# EAGLE design PowerLcd (EAGLE 9.6.2)
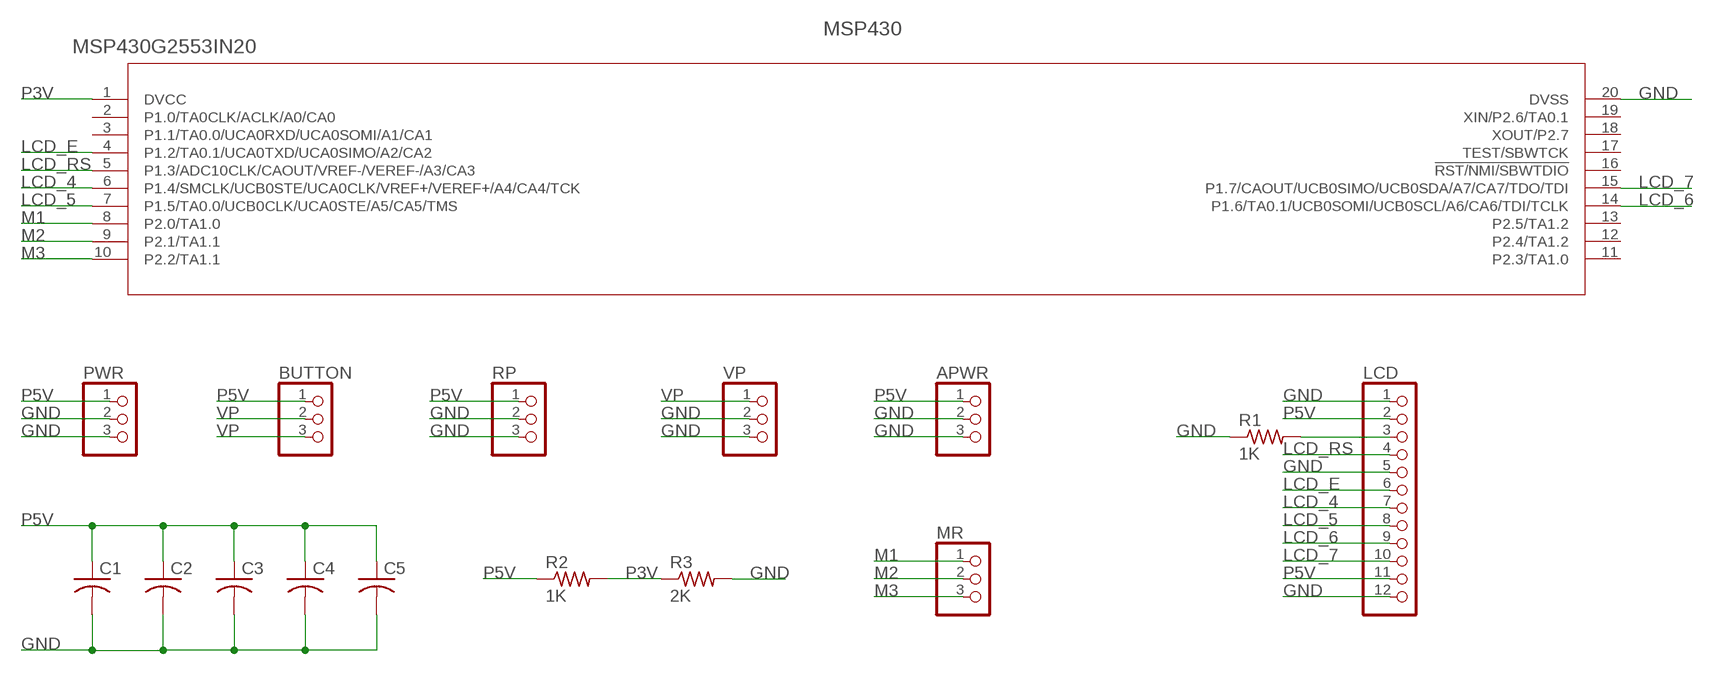
[diagram p0: schematic, sheet 1]

## Parts
APWR  PINHD-1X3  [1X03]
BUTTON  PINHD-1X3  [1X03]
C1  C-US075-042X103  [C075-042X103]
C2  C-US075-042X103  [C075-042X103]
C3  C-US075-042X103  [C075-042X103]
C4  C-US075-042X103  [C075-042X103]
C5  C-US075-042X103  [C075-042X103]
LCD  PINHD-1X12  [1X12]
MR  PINHD-1X3  [1X03]
MSP430  MSP430G2553IN20  [N20_TEX]
PWR  PINHD-1X3  [1X03]
R1  1K  R-US_0204/5  [0204/5]
R2  1K  R-US_0204/5  [0204/5]
R3  2K  R-US_0204/5  [0204/5]
RP  PINHD-1X3  [1X03]
VP  PINHD-1X3  [1X03]

## Nets
GND: APWR.2 APWR.3 C1.2 C2.2 C3.2 C4.2 C5.2 LCD.1 LCD.5 LCD.12 MSP430.20(DVSS) PWR.2 PWR.3 R1.1 R3.2 RP.2 RP.3 VP.2 VP.3
LCD_4: LCD.7 MSP430.6(P1.4/SMCLK/UCB0STE/UCA0CLK/VREF+/VEREF+/A4/CA4/TCK)
LCD_5: LCD.8 MSP430.7(P1.5/TA0.0/UCB0CLK/UCA0STE/A5/CA5/TMS)
LCD_6: LCD.9 MSP430.14(P1.6/TA0.1/UCB0SOMI/UCB0SCL/A6/CA6/TDI/TCLK)
LCD_7: LCD.10 MSP430.15(P1.7/CAOUT/UCB0SIMO/UCB0SDA/A7/CA7/TDO/TDI)
LCD_E: LCD.6 MSP430.4(P1.2/TA0.1/UCA0TXD/UCA0SIMO/A2/CA2)
LCD_RS: LCD.4 MSP430.5(P1.3/ADC10CLK/CAOUT/VREF-/VEREF-/A3/CA3)
M1: MR.1 MSP430.8(P2.0/TA1.0)
M2: MR.2 MSP430.9(P2.1/TA1.1)
M3: MR.3 MSP430.10(P2.2/TA1.1)
N$5: LCD.3 R1.2
P3V: MSP430.1(DVCC) R2.2 R3.1
P5V: APWR.1 BUTTON.1 C1.1 C2.1 C3.1 C4.1 C5.1 LCD.2 LCD.11 PWR.1 R2.1 RP.1
VP: BUTTON.2 BUTTON.3 VP.1
Unconnected: MSP430.2(P1.0/TA0CLK/ACLK/A0/CA0) MSP430.3(P1.1/TA0.0/UCA0RXD/UCA0SOMI/A1/CA1) MSP430.11(P2.3/TA1.0) MSP430.12(P2.4/TA1.2) MSP430.13(P2.5/TA1.2) MSP430.16(!RST/NMI/SBWTDIO) MSP430.17(TEST/SBWTCK) MSP430.18(XOUT/P2.7) MSP430.19(XIN/P2.6/TA0.1)

## Library data of the parts
APWR BUTTON MR PWR RP VP = adafruit:PINHD-1X3: PIN HEADER
C1-C5 = adafruit:C-US: CAPACITOR, American symbol
LCD = adafruit:PINHD-1X12: PIN HEADER
MSP430 = msp32pin:MSP430G2553IN20; BUILT_BY: EMA_UL_Team; MANUFACTURER_PART_NUMBER: MSP430G2553IN20; SOURCELIBRARY: TI_2016-12-05; VENDOR: Texas Instruments
R1-R3 = rcl:R-US_: RESISTOR, American symbol; SPICEPREFIX: R

## Board
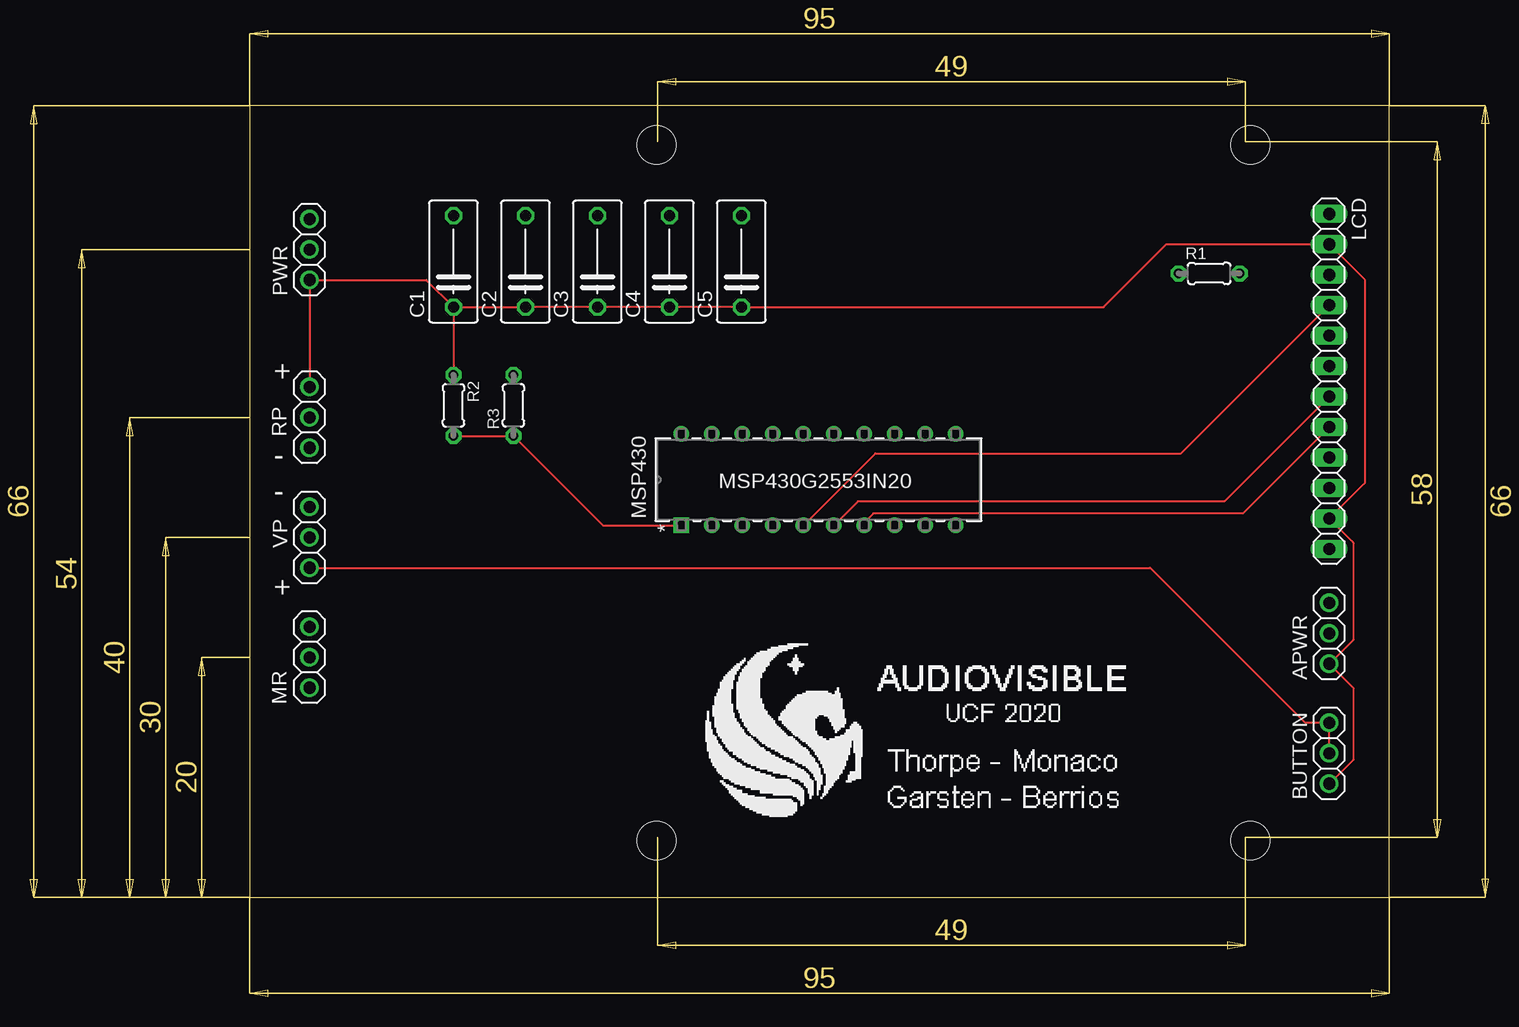
[diagram p1: board, top side]
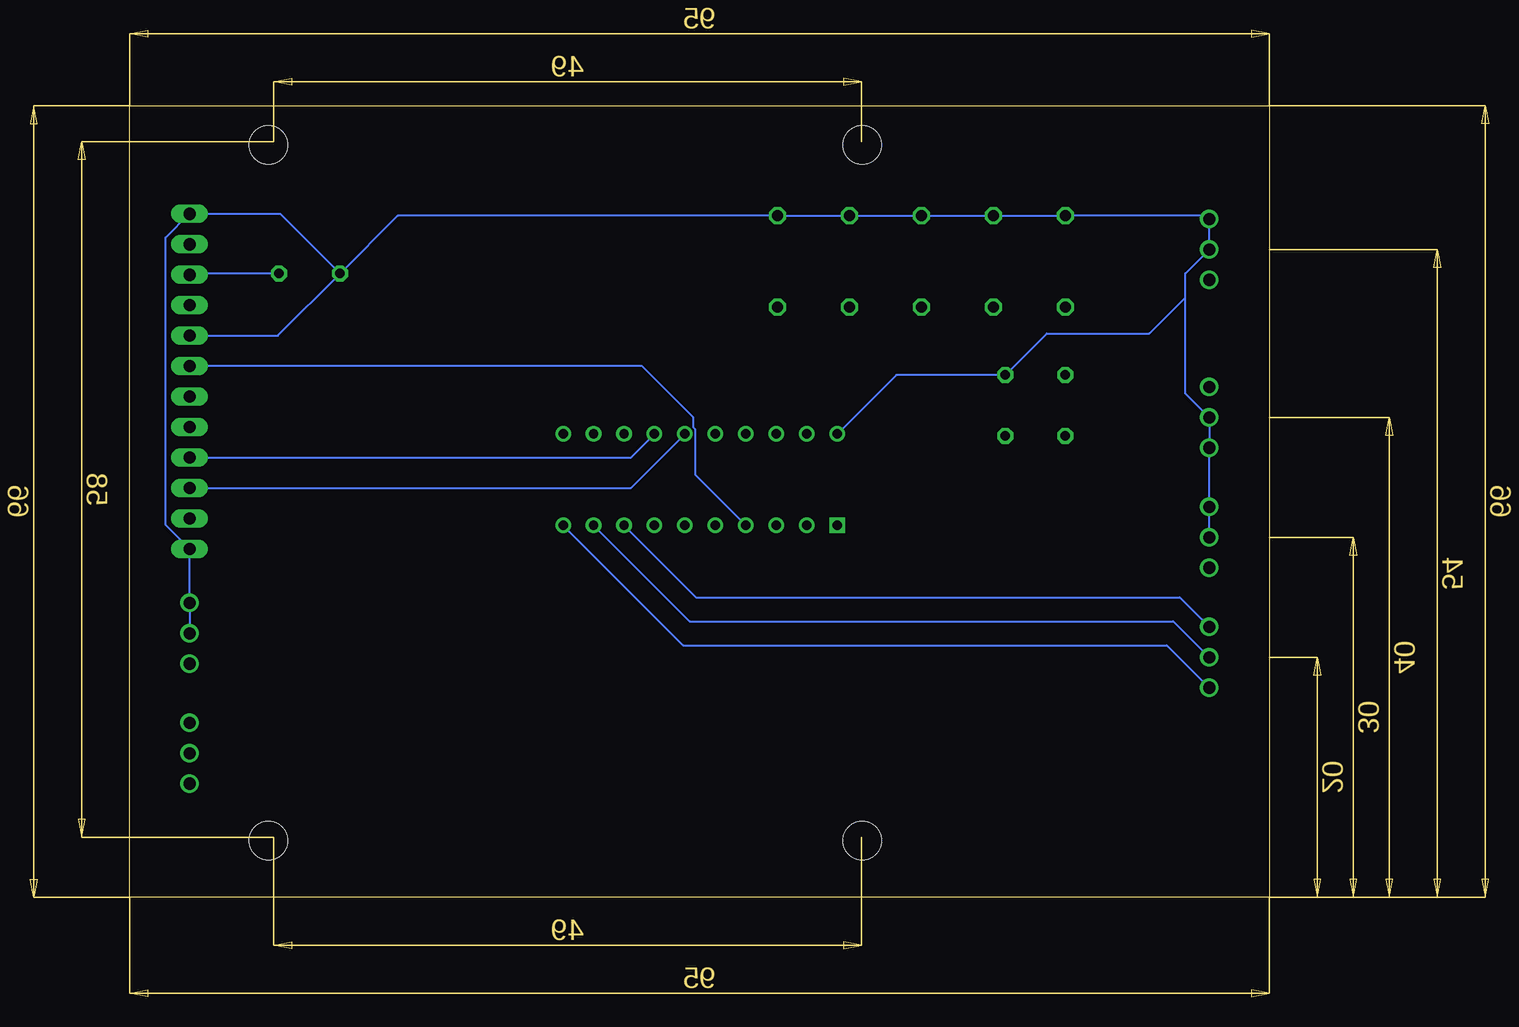
[diagram p2: board, bottom side, seen from below]

Size 95 x 66 mm. Coordinates in mm from the lower left corner, seen from the top.
Outline: 0,0 95,0 95,66 0,66 0,0
Copper layers (1*16): Top 0.035mm / dielectric 1.5mm / Bottom 0.035mm
Design rules "default": minimum track width 6mil, minimum drill 0.35mm, track to track 6mil, track to pad 6mil, pad to pad 6mil, via to via 6mil, smd to smd 6mil, copper to edge 40mil, drill to drill 6mil, minimum pad ring 10mil, minimum via ring 8mil, stop-mask expansion 4mil, vias tented up to drill 0mil, thermal gap 10mil

### Footprints (pad centres in the part's own frame; a part is rotated, then mirrored left to right if it is on the bottom)
1X03 = drill 1.016: 1 -2.54,0; 2 0,0; 3 2.54,0
C075-042X103 = drill 0.914 octagon: 1 -3.81,0; 2 3.81,0
1X12 = drill 1.016 long: 1 -13.97,0; 2 -11.43,0; 3 -8.89,0; 4 -6.35,0; 5 -3.81,0; 6 -1.27,0; 7 1.27,0; 8 3.81,0; 9 6.35,0; 10 8.89,0; 11 11.43,0; 12 13.97,0
N20_TEX = drill 0.787 pad 1.295 square: 1 0,0 | drill 0.787 pad 1.295: 2 0,-2.54; 3 0,-5.08; 4 0,-7.62; 5 0,-10.16; 6 0,-12.7; 7 0,-15.24; 8 0,-17.78; 9 0,-20.32; 10 0,-22.86; 11 7.62,-22.86; 12 7.62,-20.32; 13 7.62,-17.78; 14 7.62,-15.24; 15 7.62,-12.7; 16 7.62,-10.16; 17 7.62,-7.62; 18 7.62,-5.08; 19 7.62,-2.54; 20 7.62,0
0204/5 = drill 0.813 octagon: 1 -2.54,0; 2 2.54,0
3_2_HOLE = hole 3.2: -1.57,1.73

### Placement (x,y rotation side)
APWR  90,22 90 top
BUTTON  90,12 90 top
C1  17,53 90 top
C2  23,53 90 top
C3  29,53 90 top
C4  35,53 90 top
C5  41,53 90 top
LCD  90,43 270 top
MR  5,20 270 top
MSP430  36,31 90 top
PWR  5,54 90 top
R1  80,52 0 top
R2  17,41 270 top
R3  22,41 90 top
RP  5,40 270 top
U$1  [3_2_HOLE]  85,3 0 top
U$2  [3_2_HOLE]  85,61 0 top
U$7  [3_2_HOLE]  35.5,61 0 top
U$8  [3_2_HOLE]  35.5,3 0 top
VP  5,30 90 top

### Tracks (layer width: path | path; a pad name or v marks a point on that pad's centre or on a via)
GND
  Bottom 0.152: VP.2 VP.3 RP.3 RP.2 7,42 7,50 | R1.1 72.65,56.81 C5.2 C4.2 C3.2 C2.2 C1.2 5.27,56.81 PWR.3 PWR.2 7,52 7,50 | LCD.5 82.65,46.81 R1.1 | APWR.2 APWR.3 LCD.12 92,31.03 92,55 90.02,56.98 89.98,56.98 LCD.1 82.43,56.97 R1.1 | MSP430.20 31.08,43.54 R3.2 18.54,47 10,47 7,50
LCD_4
  Top 0.152: LCD.7 81.27,33 50.7,33 MSP430.6
LCD_5
  Top 0.152: LCD.8 82.81,32 52,32 51.24,31.24 MSP430.7
LCD_6
  Bottom 0.152: LCD.9 53.21,36.65 MSP430.14
LCD_7
  Bottom 0.152: LCD.10 53.21,34.11 MSP430.15
LCD_E
  Bottom 0.152: MSP430.4 47.82,35.2 47.82,38.98 48,39.16 48,40 52.27,44.27 LCD.6
LCD_RS
  Top 0.152: MSP430.5 52.16,37 77.65,37 LCD.4
M1
  Bottom 0.152: MR.1 7.46,25 47.78,25 MSP430.8
M2
  Bottom 0.152: MR.2 8,23 48.32,23 MSP430.9
M3
  Bottom 0.152: MR.3 8.54,21 48.86,21 MSP430.10
N$5
  Bottom 0.152: R1.2 89.89,52 LCD.3
P3V
  Top 0.152: MSP430.1 29.46,31 R3.1 R2.2
P5V
  Top 0.152: C1.1 14.73,51.46 PWR.1 RP.1 | C1.1 C2.1 C3.1 C4.1 C5.1 71.19,49.19 76.43,54.43 LCD.2 93,51.43 93,34.57 LCD.11 92,29.57 92,21.46 APWR.1 92,17.46 92,11.46 BUTTON.1 | C1.1 R2.1
VP
  Top 0.152: BUTTON.2 BUTTON.3 88,14.54 77.77,24.77 77.54,25 75.08,27.46 VP.1

### Text on the board
tPlace: + | - | - | +